# EAGLE design photon_rj45 (EAGLE 8.5.0)
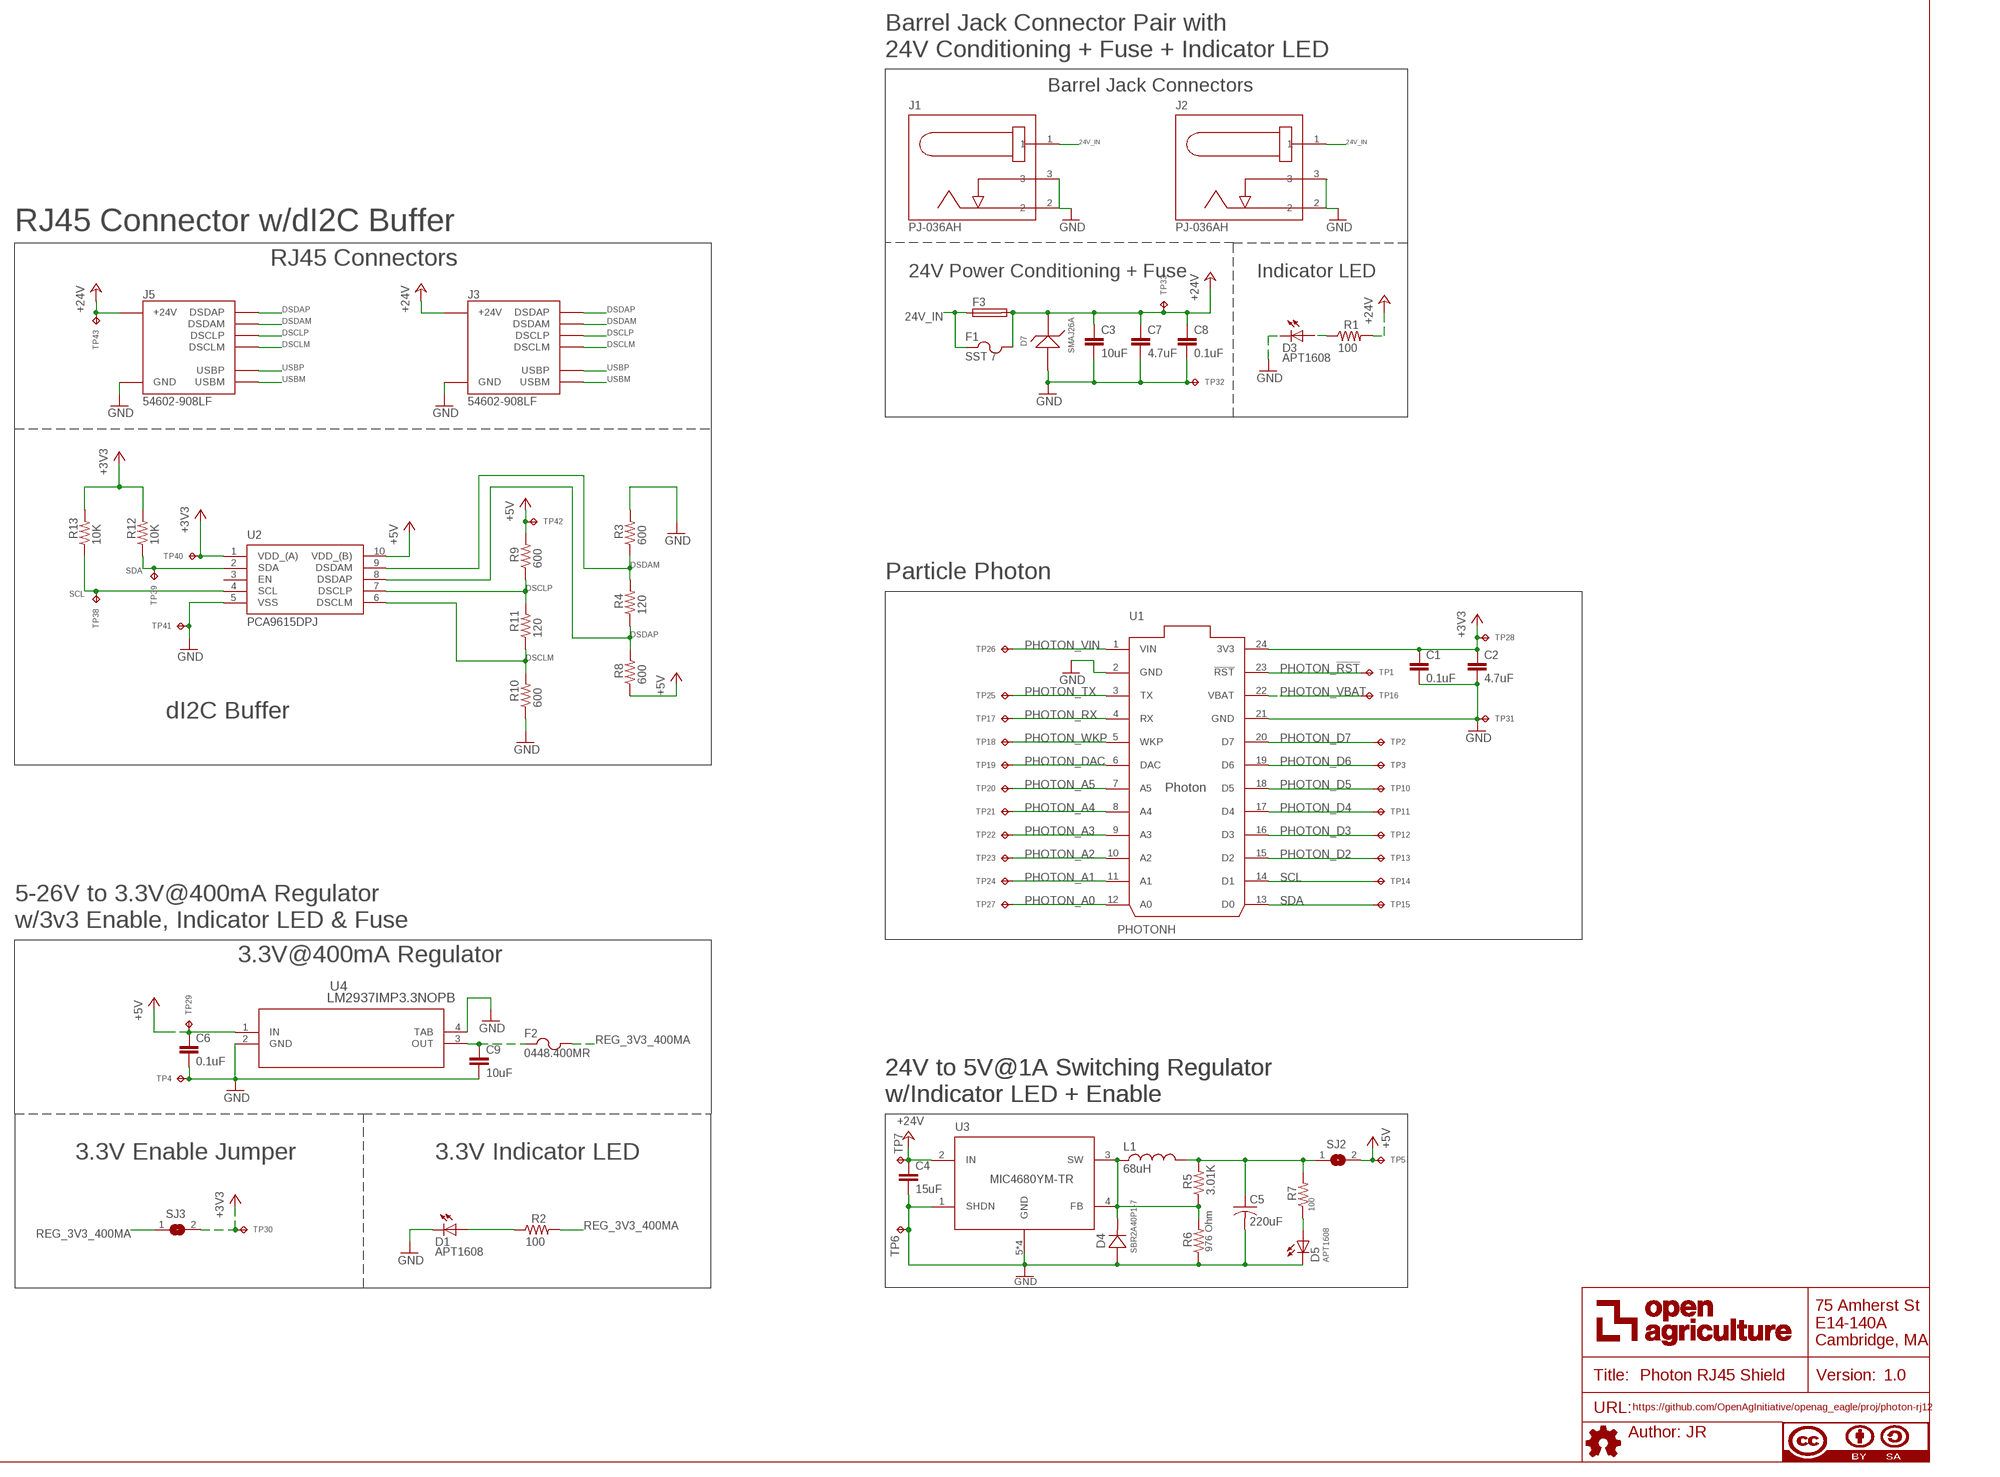
[diagram p0: schematic, sheet 1]

## Parts
C1  0.1uF  0.1UF-C0603C104K5RACTU  [C0603]
C2  4.7uF  4.7UF-CL21A475KBQNNNE  [C0805]
C3  10uF  10UF-GMK212BBJ106KG-T  [C0805]
C4  15uF  15UF-C2012X5R1V156M125AC  [C0805]
C5  220uF  220UF-TPSY227K010R0100  [CT7343]
C6  0.1uF  0.1UF-C0603C104K5RACTU  [C0603]
C7  4.7uF  4.7UF-CL21A475KBQNNNE  [C0805]
C8  0.1uF  0.1UF-C0603C104K5RACTU  [C0603]
C9  10uF  10UF-GMK212BBJ106KG-T  [C0805]
D1  APT1608  APT1608CGCK  [CHIPLED_0603]
D3  APT1608  APT1608CGCK  [CHIPLED_0603]
D4  SBR2A40P1-7  [POWERDI123]
D5  APT1608  APT1608CGCK  [CHIPLED_0603]
D7  SMAJ26A  SMAJ26A-13-F  [SMA]
F1  SST 7  SST_7  [SS]
F2  0448.400MR  0438.375WR  [0603]
F3  GSH15  [GSH15]
FRAME1  DOCFIELD  [DOCFIELD]
J1  PJ-036AH  PJ-036AH-SMT-TR  [PJ-036AH]
J2  PJ-036AH  PJ-036AH-SMT-TR  [PJ-036AH]
J3  54602-908LF  OPENAG-V1-RJ45PTH  [OPENAG-V1-RJ45]
J5  54602-908LF  OPENAG-V1-RJ45PTH  [OPENAG-V1-RJ45]
L1  68uH  68UH-UP2B-680-R  [UP2B]
R1  100  100OHM-RC0603JR-07100RL  [RC0603N]
R2  100  100OHM-RC0603JR-07100RL  [RC0603N]
R3  600  600OHM-RC0603FR-07604RL  [RC0603N]
R4  120  120OHM-RC0603FR-07120RL  [RC0603N]
R5  3.01K  3.01K-RC0603FR-073K01L  [RC0603N]
R6  976 Ohm  982OHM-RC0603FR-07976RL  [RC0603N]
R7  100  100OHM-RC0603JR-07100RL  [RC0603N]
R8  600  600OHM-RC0603FR-07604RL  [RC0603N]
R9  600  600OHM-RC0603FR-07604RL  [RC0603N]
R10  600  600OHM-RC0603FR-07604RL  [RC0603N]
R11  120  120OHM-RC0603FR-07120RL  [RC0603N]
R12  10K  10K-ERJ-3EKF1002V  [RC0603N]
R13  10K  10K-ERJ-3EKF1002V  [RC0603N]
SJ2  SOLDERJUMPERREFLOW_NOPASTE  [SOLDERJUMPER_REFLOW_NOPASTE]
SJ3  SOLDERJUMPERREFLOW_NOPASTE  [SOLDERJUMPER_REFLOW_NOPASTE]
TP1  TPTP04R  [TP04R]
TP2  TPTP04R  [TP04R]
TP3  TPTP04R  [TP04R]
TP4  TPTP06R  [TP06R]
TP5  TPTP06R  [TP06R]
TP6  TPTP06R  [TP06R]
TP7  TPTP06R  [TP06R]
TP10  TPTP04R  [TP04R]
TP11  TPTP04R  [TP04R]
TP12  TPTP04R  [TP04R]
TP13  TPTP04R  [TP04R]
TP14  TPTP04R  [TP04R]
TP15  TPTP04R  [TP04R]
TP16  TPTP04R  [TP04R]
TP17  TPTP04R  [TP04R]
TP18  TPTP04R  [TP04R]
TP19  TPTP04R  [TP04R]
TP20  TPTP04R  [TP04R]
TP21  TPTP04R  [TP04R]
TP22  TPTP04R  [TP04R]
TP23  TPTP04R  [TP04R]
TP24  TPTP04R  [TP04R]
TP25  TPTP04R  [TP04R]
TP26  TPTP04R  [TP04R]
TP27  TPTP04R  [TP04R]
TP28  TPTP04R  [TP04R]
TP29  TPTP06R  [TP06R]
TP30  TPTP06R  [TP06R]
TP31  TPTP04R  [TP04R]
TP32  TPTP06R  [TP06R]
TP33  TPTP06R  [TP06R]
TP38  TPTP06R  [TP06R]
TP39  TPTP06R  [TP06R]
TP40  TPTP06R  [TP06R]
TP41  TPTP06R  [TP06R]
TP42  TPTP06R  [TP06R]
TP43  TPTP06R  [TP06R]
U1  PHOTONH  PHOTONHPHOTONH  [PHOTON]
U2  PCA9615DPJ  [SOP50P490X110-10N]
U3  MIC4680YM-TR  [SOIC8]
U4  LM2937IMP3.3NOPB  LM2937IMP-3.3/NOPB  [MP04A]

## Nets
24V_IN: F1.1 F3.1 J1.1 J2.1
+3V3: C1.1 C2.1 R12.2 R13.2 SJ3.2 TP28.1(TP) TP30.TP TP40.TP U1.24(3V3) U2.1(VDD_(A))
+5V: C6.1 R8.1 R9.2 SJ2.2 TP5.TP TP29.TP TP42.TP U2.10(VDD_(B)) U4.1(IN)
+24V: C3.1 C4.1 C7.1 C8.1 D7.1 F1.2 F3.2 J3.24V(6)(+24V) J5.24V(6)(+24V) R1.2 TP7.TP TP33.TP TP43.TP U3.2(IN)
DSCLM: J3.DSCLM(5)(DSCLM) J5.DSCLM(5)(DSCLM) R10.2 R11.1 U2.6(DSCLM)
DSCLP: J3.DSCLP(4)(DSCLP) J5.DSCLP(4)(DSCLP) R9.1 R11.2 U2.7(DSCLP)
DSDAM: J3.DSDAM(2)(DSDAM) J5.DSDAM(2)(DSDAM) R3.1 R4.2 U2.9(DSDAM)
DSDAP: J3.DSDAP(1)(DSDAP) J5.DSDAP(1)(DSDAP) R4.1 R8.2 U2.8(DSDAP)
GND: C1.2 C2.2 C3.2 C4.2 C5.-(2(-)) C6.2 C7.2 C8.2 C9.2 D1.C D3.C D4.- D5.C D7.2 J1.2 J1.3 J2.2 J2.3 J3.GND(3)(GND) J5.GND(3)(GND) R3.2 R6.1 R10.1 TP4.TP TP6.TP TP31.1(TP) TP32.TP TP41.TP U1.2(GND) U1.21(GND) U2.5(VSS) U3.1(SHDN) U3.5(GND) U3.6(GND) U3.7(GND) U3.8(GND) U4.2(GND) U4.4(TAB)
N$4: D1.A R2.1
N$5: C9.1 F2.1 U4.3(OUT)
N$7: D3.A R1.1
N$31: D4.+ L1.1 R5.1 R6.2 U3.3(SW) U3.4(FB)
N$32: D5.A R7.1
N$33: C5.+(1(+)) L1.2 R5.2 R7.2 SJ2.1
PHOTON_!RST!: TP1.1(TP) U1.23(!RST)
PHOTON_A0: TP27.1(TP) U1.12(A0)
PHOTON_A1: TP24.1(TP) U1.11(A1)
PHOTON_A2: TP23.1(TP) U1.10(A2)
PHOTON_A3: TP22.1(TP) U1.9(A3)
PHOTON_A4: TP21.1(TP) U1.8(A4)
PHOTON_A5: TP20.1(TP) U1.7(A5)
PHOTON_D2: TP13.1(TP) U1.15(D2)
PHOTON_D3: TP12.1(TP) U1.16(D3)
PHOTON_D4: TP11.1(TP) U1.17(D4)
PHOTON_D5: TP10.1(TP) U1.18(D5)
PHOTON_D6: TP3.1(TP) U1.19(D6)
PHOTON_D7: TP2.1(TP) U1.20(D7)
PHOTON_DAC: TP19.1(TP) U1.6(DAC)
PHOTON_RX: TP17.1(TP) U1.4(RX)
PHOTON_TX: TP25.1(TP) U1.3(TX)
PHOTON_VBAT: TP16.1(TP) U1.22(VBAT)
PHOTON_VIN: TP26.1(TP) U1.1(VIN)
PHOTON_WKP: TP18.1(TP) U1.5(WKP)
REG_3V3_400MA: F2.2 R2.2 SJ3.1
SCL: R13.1 TP14.1(TP) TP38.TP U1.14(D1) U2.4(SCL)
SDA: R12.1 TP15.1(TP) TP39.TP U1.13(D0) U2.2(SDA)
USBM: J3.USBM(8)(USBM) J5.USBM(8)(USBM)
USBP: J3.USBP(7)(USBP) J5.USBP(7)(USBP)
Unconnected: U2.3(EN)

## Notes on the sheet
- Barrel Jack Connector Pair with 
  24V Conditioning + Fuse + Indicator LED
- Barrel Jack Connectors
- RJ45 Connector w/dI2C Buffer
- RJ45 Connectors
- 24V Power Conditioning + Fuse | Indicator LED
- Particle Photon
- dI2C Buffer
- 5-26V to 3.3V@400mA Regulator 
  w/3v3 Enable, Indicator LED & Fuse
- 3.3V@400mA Regulator
- 24V to 5V@1A Switching Regulator
  w/Indicator LED + Enable
- 24V to 5V@1A Switching Regulator
  w/Indicator LED + Enable
- 3.3V Enable Jumper | 3.3V Indicator LED

## Library data of the parts
C1 C6 C8 = openag-capacitors:0.1UF-C0603C104K5RACTU: Kemet - C0603C104K5RACTU - CAP CER 0.1UF 50V X7R 0603 Description: 0.1µF ±10% 50V Ceramic Capacitor X7R 0603 (1608 Metric) Technical Specifications: Capacitance: 0.1µF Tolerance: ±10% Rated Voltage: 50V Temperature Coefficient: X7R Operating Temperature: -55°C ~ 125°C Package / Case: 0603 (1608 Metric) Datasheet(s): X7R Dielectric, 6.3-250 VDC <https://search.kemet.com/component-edge/download/datasheet/C0603C104K5RACTU.pdf> Vendor(s): Digikey: 399-5089-1-ND <https://www.digikey.com/product-detail/en/kemet/C0603C104K5RACTU/399-5089-1-ND/1465623>; POPULATE: YES; VERIFIED: NO
C2 C7 = openag-capacitors:4.7UF-CL21A475KBQNNNE: Samsung - CL21A475KBQNNNE - CAP CER 4.7UF 50V X5R 0805 Description: 4.7µF ±10% 50V Ceramic Capacitor X5R 0805 (2012 Metric) Technical Specifications: Capacitance: 4.7uF Tolerance: ±10% Rated Voltage: 50V Temperature Coefficient: X5R Operating Temperature: -55°C ~ 85°C Package/Case: 0805 (2012 Metric) Datasheet(s): CL21A475KBQNNNE Characteristics <http://www.samsungsem.com/kr/front/downloadcms.do?path=/kr/support/product-search/mlcc/__icsFiles/afieldfile/2014/11/05&fileName=C_CL21A475KBQNNNE.pdf> Vendor(s): Digikey: 1276-1248-1-ND <https://www.digikey.com/product-detail/en/samsung-electro-mechanics/CL21A475KBQNNNE/1276-1248-1-ND/3889334>; POPULATE: YES; VERIFIED: NO
C3 C9 = openag-capacitors:10UF-GMK212BBJ106KG-T: Taiyo Yuden - GMK212BBJ106KG-T - CAP CER 10UF 35V X5R 0805 Description: 10µF ±10% 35V Ceramic Capacitor X5R 0805 (2012 Metric) Technical Specifications: Capacitance: 10µF Tolerance: ±10% Rated Voltage: 35V Temperature Coefficient: X5R Operating Temperature: -55°C ~ 85°C Package / Case: 0805 (2012 Metric) Datasheet(s): GMK212BBJ106KG-T Spec <http://ds.yuden.co.jp/TYCOMPAS/ut/detail.do?productNo=GMK212BBJ106KG-T&fileName=GMK212BBJ106KG-T_SS&mode=specSheetDownload> Vendor(s): Digikey: 587-4893-1-ND <https://www.digikey.com/product-detail/en/taiyo-yuden/GMK212BBJ106KG-T/587-4893-1-ND/6563736>; POPULATE: YES; VERIFIED: NO
C4 = openag-capacitors:15UF-C2012X5R1V156M125AC: TDK Corporation - C2012X5R1V156M125AC - CAP CER 15UF 35V X5R 0805 Description: 15µF ±20% 35V Ceramic Capacitor X5R 0805 (2012 Metric) Technical Specifications: Capacitance: 15µF Tolerance: ±20% Voltage - Rated: 35V Temperature Coefficient: X5R Operating Temperature: -55°C ~ 85°C Features: Low ESL Applications: General Purpose Mounting Type: Surface Mount, MLCC Package / Case: 0805 (2012 Metric) Size / Dimension: 0.079" L x 0.049" W (2.00mm x 1.25mm) Thickness (Max): 0.057" (1.45mm) Datasheet(s): C Series, General Datasheet <https://product.tdk.com/info/en/catalog/datasheets/mlcc_commercial_general_en.pdf> MLCC Part Number Guide <https://product.tdk.com/en/products/common/pdf/mlcc_partnumber_description.pdf> C Series, Gen Appl & Mid-Voltage Spec <https://product.tdk.com/info/en/catalog/spec/mlccspec_commercial_general_midvoltage_en.pdf> Vendor(s): Digikey: 445-14423-1-ND <https://www.digikey.com/product-detail/en/tdk-corporation/C2012X5R1V156M125AC/445-14423-1-ND/3956089>
C5 = openag-capacitors:220UF-TPSY227K010R0100: AVX Corporation - TPSY227K010R0100 - CAP TANT 220UF 10V 10% 2917 Description: 220µF Molded Tantalum Capacitors 10V 2917 (7343 Metric) 100 mOhm Technical Specifications: Capacitance: 220µF Tolerance: ±10% Voltage - Rated: 10V Type: Molded ESR (Equivalent Series Resistance): 100 mOhm Operating Temperature: -55°C ~ 125°C Mounting Type: Surface Mount Package / Case: 2917 (7343 Metric) Size / Dimension: 0.287" L x 0.169" W (7.30mm x 4.30mm) Height - Seated (Max): 0.079" (2.00mm) Manufacturer Size Code: Y Features: General Purpose Datasheet(s): TPS Series, Low ESR <http://datasheets.avx.com/TPS.pdf> Vendor(s): Digikey: 478-5408-1-ND <https://www.digikey.com/scripts/DkSearch/dksus.dll?Detail&itemSeq=250948888&uq=636531796868737363>
D1 D3 D5 = openag-diodes:APT1608CGCK: Kingbright - APT1608CGCK - LED GREEN CLEAR 0603 SMD Description: Green 570nm LED Indication - Discrete 2.1V 0603 (1608 Metric) Technical Specifications: Color: Green Lens Color: Colorless Lens Transparency: Clear Millicandela Rating: 50mcd Lens Style/Size: Rectangle with Flat Top, 1.20mm x 0.80mm Voltage - Forward (Vf) (Typ): 2.1V Current - Test: 20mA Viewing Angle: 120° Mounting Type: Surface Mount Wavelength - Dominant: 570nm Wavelength - Peak: 574nm Package / Case: 0603 (1608 Metric) Supplier Device Package: Chip LED Size / Dimension: 1.60mm L x 0.80mm W Height (Max): 0.75mm Datasheet(s): APT1608CGCK <http://www.kingbrightusa.com/images/catalog/SPEC/APT1608CGCK.pdf> Vendor(s): Digikey: 754-1116-1-ND <https://www.digikey.com/product-detail/en/kingbright/APT1608CGCK/754-1116-1-ND/1747833#>; POPULATE: YES; VERIFIED: NO
D4 = openag-diodes:SBR2A40P1-7: Diodes Incorporated - SBR2A40P1-7 - DIODE SBR 40V 2A POWERDI123 Description: Diode Super Barrier 40V 2A Surface Mount PowerDI™ 123 Technical Specifications: Diode Type: Super Barrier Voltage - DC Reverse (Vr) (Max): 40V Current - Average Rectified (Io): 2A Voltage - Forward (Vf) (Max) @ If: 500mV @ 2A Speed: Standard Recovery >500ns, > 200mA (Io) Current - Reverse Leakage @ Vr: 100µA @ 40V Mounting Type: Surface Mount Package / Case: POWERDI®123 Supplier Device Package: PowerDI™ 123 Operating Temperature - Junction: -65°C ~ 150°C Base Part Number: SBR2A40 Datasheet(s): SBR2A40P1 <https://www.diodes.com/assets/Datasheets/SBR2A40P1.pdf> Vendor(s): Digikey: SBR2A40P1DITR-ND <https://www.digikey.com/product-detail/en/diodes-incorporated/SBR2A40P1-7/SBR2A40P1DITR-ND/1681825>
D7 = openag-diodes:SMAJ26A-13-F: Diodes Incorporated - SMAJ26A-13-F - TVS DIODE 26VWM 42.1VC SMA Description: TVS DIODE 26VWM 42.1VC SMA Technical Specifications: Type: Zener Voltage - Reverse Standoff (Typ): 26V Voltage - Breakdown (Min): 28.9V Voltage - Clamping (Max) @ Ipp: 42.1V Current - Peak Pulse (10/1000µs): 9.5A Power - Peak Pulse: 400W Power Line Protection: No Operating Temperature: -55°C ~ 150°C (TJ) DO-214AC, SMA Datasheet(s): SMAJ5.0(C)A - SMAJ200(C)A Vendor(s): Digikey: SMAJ26A-FDICT-ND <https://www.digikey.com/product-detail/en/diodes-incorporated/SMAJ26A-13-F/SMAJ26A-FDICT-ND/806583>
F1 = openag-fuses:SST_7: Bel Fuse - SST7 - FUSE BRD MNT 7A 125VAC/VDC 2SMD Description: FUSE BRD MNT 7A 125VAC/VDC 2SMD Technical Specifications: Current Rating: 7A Voltage Rating: 125V Fuse Type: Board Mount (Cartridge Style Excluded) Mounting Type: Surface Mount Operating Temperature: -55°C ~ 125°C Datasheet(s): SST Type <https://belfuse.com/resources/StewartConnector/SST.pdf> Vendor(s): Digikey: 507-1072-1-ND <https://www.digikey.com/product-detail/en/bel-fuse-inc/SST-7/507-1072-1-ND/615026>; POPULATE: YES; VERIFIED: NO
F2 = openag-fuses:0438.375WR: Littelfuse Inc. - 0448.400MR - FUSE BOARD MNT 400MA 125VAC/VDC Description: FUSE BOARD MNT 400MA 125VAC/VDC Technical Specifications: Fuse Type: Board Mount (Cartridge Style Excluded) Current Rating: 400mA Voltage Rating - AC: 125V Voltage Rating - DC: 125V Response Time: Fast Package / Case: 2-SMD, Square End Block Mounting Type: Surface Mount Breaking Capacity @ Rated Voltage: 50A Melting I²t: 0.0416 Approvals: CSA, UL Operating Temperature: -55°C ~ 125°C Size / Dimension: 0.240" L x 0.106" W x 0.106" H (6.10mm x 2.69mm x 2.69mm) DC Cold Resistance: 0.4895 Ohms Datasheet(s): 448 Series Datasheet <http://www.littelfuse.com/~/media/electronics/datasheets/fuses/littelfuse_fuse_448_datasheet.pdf.pdf> Vendor(s): Digikey: F5573CT-ND <https://www.digikey.com/product-detail/en/littelfuse-inc/0448.400MR/F5573CT-ND/3306934>; POPULATE: YES; VERIFIED: YES
F3 = fuse:GSH15: FUSE HOLDER grid 15mm, 19649 Wickmann; MPN: 64900001039; OC_FARNELL: 1271673; OC_NEWARK: 02P0318
FRAME1 = openag-frames:DOCFIELD: DOCUMENT FIELD; AUTHOR: JR; TITLE: Photon RJ45 Shield; URL: https://github.com/OpenAgInitiative/openag_eagle/proj/photon-rj12; VER: 1.0
J1 J2 = openag-connectors:PJ-036AH-SMT-TR: CUI Inc. - PJ-036AH-SMT-TR - CONN PWR JACK 2X5.5MM SOLDER Description: Power Barrel Connector Jack 2.10mm ID (0.083"), 5.50mm OD (0.217") Surface Mount, Right Angle Technical Specifications: Connector Type: Jack Gender: Male Industry Recognized Mating Diameter: 2.10mm ID (0.083"), 5.50mm OD (0.217") Actual Diameter: 0.078" (2.00mm ID), 0.248" (6.30mm OD) Number of Positions/Contacts: 2 Conductors, 3 Contacts Internal Switch(s): Single Switch, Normally Closed Mounting Type: Surface Mount, Right Angle Termination: Solder Shielding: Unshielded Voltage - Rated: 24VDC Current Rating: 5A Mating Length/Depth: 0.360" (9.15mm) Contact Material - Plating: Silver Operating Temperature: -25°C ~ 85°C Housing Material: Polyamide (PA6T), Nylon 6T Contact Material: Brass; Copper Alloy Body Color: Black Datasheet(s): PJ-036AH-SMT-TR <http://www.cui.com/product/resource/digikeypdf/pj-036ah-smt-tr.pdf> Vendor(s): Digikey: CP-036AHPJCT-ND <https://www.digikey.com/product-detail/en/cui-inc/PJ-036AH-SMT-TR/CP-036AHPJCT-ND/1530994>
J3 J5 = openag_connector:OPENAG-V1-RJ45: Amphenol FCI - 54602-908LF - CONN MOD JACK 8P8C R/A UNSHLD Description: Jack Modular Connector 8p8c (RJ45, Ethernet) 90� Angle (Right) Unshielded Cat3 Technical Specifications: Connector Type: Jack Number of Positions/Contacts: 8p8c (RJ45, Ethernet) Number of Ports: 1 Number of Rows: 1 Mounting Type: Through Hole Orientation: 90� Angle (Right) Termination: Solder Shielding: Unshielded Ratings: Cat3 Features: Board Lock LED Color: Does Not Contain LED Tab Direction: Down Contact Material: Copper Alloy Contact Finish: Gold Contact Finish Thickness: 15�in (0.38�m) Housing Material: Polyester, Glass Filled Operating Temperature: -40�C ~ 70�C Datasheet(s): 54601-x04(zzz)WPLF Drawing <http://cdn.amphenol-icc.com/media/wysiwyg/files/drawing/c-bmj-0102.pdf> Vendor(s): Digikey: 609-1046-ND <https://www.digikey.com/product-detail/en/amphenol-fci/54602-908LF/609-1046-ND/1001360>; POPULATE: YES; VERIFIED: NO
L1 = openag-inductors:68UH-UP2B-680-R: Eaton - UP2B-680-R - FIXED IND 68UH 1.5A 178.7 MOHM Description: 68µH Unshielded Wirewound Inductor 1.5A 178.7 mOhm Max Nonstandard Technical Specifications: Type: Wirewound Material - Core: Ferrite Inductance: 68µH Tolerance: ±20% Current Rating: 1.5A Current - Saturation: 1.2A Shielding: Unshielded DC Resistance (DCR): 178.7 mOhm Max Operating Temperature: -40°C ~ 85°C Frequency - Test: 100kHz Mounting Type: Surface Mount Package / Case: Nonstandard Size / Dimension: 0.550" L x 0.410" W (13.97mm x 10.41mm) Height - Seated (Max): 0.236" (6.00mm) Datasheet(s): UNI-PAC (-R) <http://www.cooperindustries.com/content/dam/public/bussmann/Electronics/Resources/product-datasheets/BUS_Elx_PM_4308_UNI_PAC_Power_Inductors.pdf> Vendor(s): Digikey: 513-1083-1-ND <https://www.digikey.com/scripts/DkSearch/dksus.dll?Detail&itemSeq=250945518&uq=636531821133403587>
R1 R2 R7 = openag-resistors:100OHM-RC0603JR-07100RL: Yageo - RC0603JR-07100RL - RES SMD 100 OHM 5% 1/10W 0603 Description: 100 Ohms ±5% 0.1W, 1/10W Chip Resistor 0603 (1608 Metric) Moisture Resistant Thick Film Technical Specifications: Resistance: 100 Ohms Tolerance: ±5% Power (Watts): 0.1W, 1/10W Composition: Thick Film Features: Moisture Resistant Temperature Coefficient: ±100ppm/°C Operating Temperature: -55°C ~ 155°C Package / Case: 0603 (1608 Metric) Supplier Device Package: 0603 Size / Dimension: 0.063" L x 0.032" W (1.60mm x 0.80mm) Height - Seated (Max): 0.022" (0.55mm) Number of Terminations: 2 Datasheet(s): Thick Film Chip Resistor Intro <http://www.yageo.com.tw/exep/pages/download/literatures/PYu-R_INT-thick_7.pdf> Chip Resistor Marking <http://www.yageo.com/exep/pages/download/literatures/PYu-R_Marking_2.pdf> RC Series, L Datasheet <http://www.yageo.com/documents/recent/PYu-RC_Group_51_RoHS_L_8.pdf> Vendor(s): Digikey: 311-100GRCT-ND <https://www.digikey.com/product-detail/en/yageo/RC0603JR-07100RL/311-100GRCT-ND/729644>; POPULATE: YES; VERIFIED: NO
R3 R8-R10 = openag-resistors:600OHM-RC0603FR-07604RL: Yageo - RC0603FR-07604RL - RES SMD 604 OHM 1% 1/10W 0603 Description: 604 Ohms ±1% 0.1W, 1/10W Chip Resistor 0603 (1608 Metric) Moisture Resistant Thick Film Technical Specifications: Resistance: 604 Ohms Tolerance: ±1% Power (Watts): 0.1W, 1/10W Composition: Thick Film Features: Moisture Resistant Temperature Coefficient: ±100ppm/°C Operating Temperature: -55°C ~ 155°C Package / Case: 0603 (1608 Metric) Supplier Device Package: 0603 Size / Dimension: 0.063" L x 0.032" W (1.60mm x 0.80mm) Height - Seated (Max): 0.022" (0.55mm) Number of Terminations: 2 Datasheet(s): RC Series, L Datasheet <http://www.yageo.com/documents/recent/PYu-RC_Group_51_RoHS_L_8.pdf> Chip Resistor Marking <http://www.yageo.com/exep/pages/download/literatures/PYu-R_Marking_2.pdf> Vendor(s): Digikey: 311-604HRCT-ND <https://www.digikey.com/product-detail/en/yageo/RC0603FR-07604RL/311-604HRCT-ND/730276>
R4 R11 = openag-resistors:120OHM-RC0603FR-07120RL: Yageo - RC0603FR-07120RL - RES SMD 120 OHM 1% 1/10W 0603 Description: 120 Ohms ±1% 0.1W, 1/10W Chip Resistor 0603 (1608 Metric) Moisture Resistant Thick Film Technical Specifications: Resistance: 120 Ohms Tolerance: ±1% Power (Watts): 0.1W, 1/10W Composition: Thick Film Features: Moisture Resistant Temperature Coefficient: ±100ppm/°C Operating Temperature: -55°C ~ 155°C Package / Case: 0603 (1608 Metric) Supplier Device Package: 0603 Size / Dimension: 0.063" L x 0.032" W (1.60mm x 0.80mm) Height - Seated (Max): 0.022" (0.55mm) Number of Terminations: 2 Datasheet(s): RC Series, L Datasheet <http://www.yageo.com/documents/recent/PYu-RC_Group_51_RoHS_L_8.pdf> Chip Resistor Marking <http://www.yageo.com/exep/pages/download/literatures/PYu-R_Marking_2.pdf> Vendor(s): Digikey: 311-120HRCT-ND <https://www.digikey.com/product-detail/en/yageo/RC0603FR-07120RL/311-120HRCT-ND/729867>
R5 = openag-resistors:3.01K-RC0603FR-073K01L: Yageo - RC0603FR-073K01L - RES SMD 3.01K OHM 1% 1/10W 0603 Description: 3.01 kOhms ±1% 0.1W, 1/10W Chip Resistor 0603 (1608 Metric) Moisture Resistant Thick Film Technical Specifications: Resistance: 3.01 kOhms Tolerance: ±1% Power (Watts): 0.1W, 1/10W Composition: Thick Film Features: Moisture Resistant Temperature Coefficient: ±100ppm/°C Operating Temperature: -55°C ~ 155°C Package / Case: 0603 (1608 Metric) Supplier Device Package: 0603 Size / Dimension: 0.063" L x 0.032" W (1.60mm x 0.80mm) Height - Seated (Max): 0.022" (0.55mm) Number of Terminations: 2 Datasheet(s): Chip Resistor Marking <http://www.yageo.com/exep/pages/download/literatures/PYu-R_Marking_2.pdf> RC Series, L Datasheet <http://www.yageo.com/documents/recent/PYu-RC_Group_51_RoHS_L_8.pdf> Vendor(s): Digikey: 311-3.01KHRCT-ND <https://www.digikey.com/scripts/DkSearch/dksus.dll?Detail&itemSeq=250949714&uq=636531832410541188>
R6 = openag-resistors:982OHM-RC0603FR-07976RL: Yageo - RC0603FR-07976RL - RES SMD 976 OHM 1% 1/10W 0603 Description: 976 Ohms ±1% 0.1W, 1/10W Chip Resistor 0603 (1608 Metric) Moisture Resistant Thick Film Technical Specifications: Resistance: 976 Ohms Tolerance: ±1% Power (Watts): 0.1W, 1/10W Composition: Thick Film Features: Moisture Resistant Temperature Coefficient: ±100ppm/°C Operating Temperature: -55°C ~ 155°C Package / Case: 0603 (1608 Metric) Supplier Device Package: 0603 Size / Dimension: 0.063" L x 0.032" W (1.60mm x 0.80mm) Height - Seated (Max): 0.022" (0.55mm) Number of Terminations: 2 Datasheet(s): Chip Resistor Marking <http://www.yageo.com/exep/pages/download/literatures/PYu-R_Marking_2.pdf> RC Series, L Datasheet <http://www.yageo.com/documents/recent/PYu-RC_Group_51_RoHS_L_8.pdf> Vendor(s): Digikey: 311-976HRCT-ND <https://www.digikey.com/scripts/DkSearch/dksus.dll?Detail&itemSeq=250949870&uq=636531835229553061>
R12 R13 = openag-resistors:10K-ERJ-3EKF1002V: Panasonic - ERJ-3EKF1002V - RES SMD 10K OHM 1% 1/10W 0603 Description: 10 kOhms ±1% 0.1W, 1/10W Chip Resistor 0603 (1608 Metric) Automotive AEC-Q200 Thick Film Technical Specifications: Resistance: 10kOhms Tolerance: ±1% Power: 0.1W, 1/10W Operating Temperature: -55°C ~ 155°C Package/Case: 0603 (1608 Metric) Datasheet(s): ERJ-3EKF1002V View All Specifications <https://industrial.panasonic.com/ww/products/resistors/chip-resistors/general-purpose-chip-resistors/precision-thick-film-chip-resistors/ERJ3EKF1002V> Vendor(s): Digikey: P10.0KHCT-ND <https://www.digikey.com/product-detail/en/panasonic-electronic-components/ERJ-3EKF1002V/P10.0KHCT-ND/198102>; POPULATE: YES; VERIFIED: NO
SJ2 SJ3 = openag-connectors:SOLDERJUMPER: SMD Solder JUMPER Solder the two pads together to create a connection, or remove the solder to break it. REFLOW - Use this footprint for solder paste and reflow ovens. WAVE - Use this footprint for hand-soldering (larger pads). CLOSED - Has a trace between the two pads to ensure it is closed by default. The trace needs to be cut to disable the jumper, and can be closed again by creating a solder bridge between the two pads.; POPULATE: YES; VERIFIED: NO
TP1-TP7 TP10-TP33 TP38-TP43 = openag-testpads:TP: Test pad
U1 = openag-microcontrollers:PHOTONH: PARTICLE - PHOTONH - Tiny Wi-Fi dev board w/cloud backend Description: The Photon is a $19 tiny Wi-Fi development kit for creating connected projects and products for the Internet of Things. It's easy to use, it's powerful, and it's connected to the cloud. Technical Specifications: Processor: STM32F205RGY6 120Mhz ARM Cortex M3 Wireless: 802.11b/g/n Wi-Fi Peripherals: Digital(x18), ADC(x8), DAC(x2), SPI(x2), I2S(x1), I2C(x1) SPI, CAN(1), USB(1), PWM(9) Memory: 1MB flash, 128KB RAM Cerfifications: FCC, CE and IC Operating Temperature: -20°C ~ 60°C Humidity Range: Non condensing, relative humidity: 95% Supply Input Voltage (VIN): 3.6V ~ 5.5V Supply Input Voltage (3V3): 3.0V ~ 3.6V Max Supply Output Current (VIN): 1A Max Supply Output Current (3V3): 100mA Average Operating Current (WiFi on, @VIN): up to 100mA Peak Operating Current (WiFi on, @VIN): up to 430mA I/O Max Source/Sink Current (Individual): 25mA I/O Max Source/Sinnk Current (Total): 120mA Datasheet(s): Photon Datasheet <https://docs.particle.io/datasheets/photon-datasheet/> Vendor(s): Particle: PHOTONH <https://store.particle.io/products/photon>; POPULATE: YES; VERIFIED: NO
U2 = openag-buffers:PCA9615DPJ: NXP USA Inc. - PCA9615DPJ - IC REDRIVER I2C 2CH 10TSSOP Description: Buffer, ReDriver 2 Channel 400kHz 10-TSSOP Technical Specifications: Type: Buffer, ReDriver Applications: I²C Input: 2-Wire Bus Output: 2-Wire Bus Data Rate (Max): 400kHz Number of Channels: 2 Capacitance - Input: 7pF Voltage - Supply: 2.3 V ~ 5.5 V Current - Supply: 16µA Operating Temperature: -40°C ~ 85°C Package / Case: 10-TFSOP, 10-MSOP (0.118", 3.00mm Width) Supplier Device Package: 10-TSSOP Base Part Number: PCA9615 Datasheet(s): PCA9615DP <http://www.nxp.com/documents/data_sheet/PCA9615.pdf> Vendor(s): Digikey: 568-11484-1-ND <https://www.digikey.com/product-detail/en/nxp-usa-inc/PCA9615DPJ/568-11484-1-ND/4864508>
U3 = openag-regulators:MIC4680YM-TR: Microchip Technology - MIC4680YM-TR - IC REG BUCK BOOST ADJ 1.3A 8SOIC Description: Buck, Buck-Boost Switching Regulator IC Positive Adjustable 1.23V 1 Output 1.3A 8-SOIC (0.154", 3.90mm Width) Technical Specifications: Function: Step-Down, Step-Up/Step-Down Output Configuration: Positive Topology: Buck, Buck-Boost Output Type: Adjustable Number of Outputs: 1 Voltage - Input (Min): 4V Voltage - Input (Max): 34V Voltage - Output (Min/Fixed): 1.23V Voltage - Output (Max): 32.98V Current - Output: 1.3A Frequency - Switching: 200kHz Synchronous Rectifier: No Operating Temperature: -40°C ~ 125°C (TJ) Mounting Type: Surface Mount Package / Case: 8-SOIC (0.154", 3.90mm Width) Supplier Device Package: 8-SOIC Base Part Number: MIC4680 Datasheet(s): MIC4680 <http://www.microchip.com/mymicrochip/filehandler.aspx?ddocname=en579250> Vendor(s): Digikey: 576-1222-1-ND <https://www.digikey.com/scripts/DkSearch/dksus.dll?Detail&itemSeq=250950999&uq=636531791983475304>
U4 = openag-regulators:LM2937IMP-3.3/NOPB: Texas Instruments - LM2937IMP-3.3/NOPB - IC REG LIN 3.3V 400MA SOT223-4 Description: Linear Voltage Regulator IC Positive Fixed 1 Output 3.3V 400mA SOT-223-4 Technical Specifications: Output Configuration: Positive Output Type: Fixed Number of Regulators: 1 Voltage - Input (Max): 26V Voltage - Output (Min/Fixed): 3.3V Voltage Dropout (Max): 1V @ 50mA Current - Output: 400mA Current - Quiescent (Iq): 2mA Current - Supply (Max): 1.25A Protection Features: Over Temperature, Reverse Polarity, Short Circuit Operating Temperature: -40°C ~ 85°C Mounting Type: Surface Mount Package / Case: TO-261-4, TO-261AA Supplier Device Package: SOT-223-4 Base Part Number: LM2937 Datasheet(s): LM2937-2.5, LM2937-3.3 Datasheet <http://www.ti.com/lit/ds/symlink/lm2937-2.5.pdf> Vendor(s): Digikey: LM2937IMP-3.3/NOPBCT-ND <https://www.digikey.com/product-detail/en/texas-instruments/LM2937IMP-3.3-NOPB/LM2937IMP-3.3-NOPBCT-ND/270742#>; POPULATE: YES; VERIFIED: NO

## Board
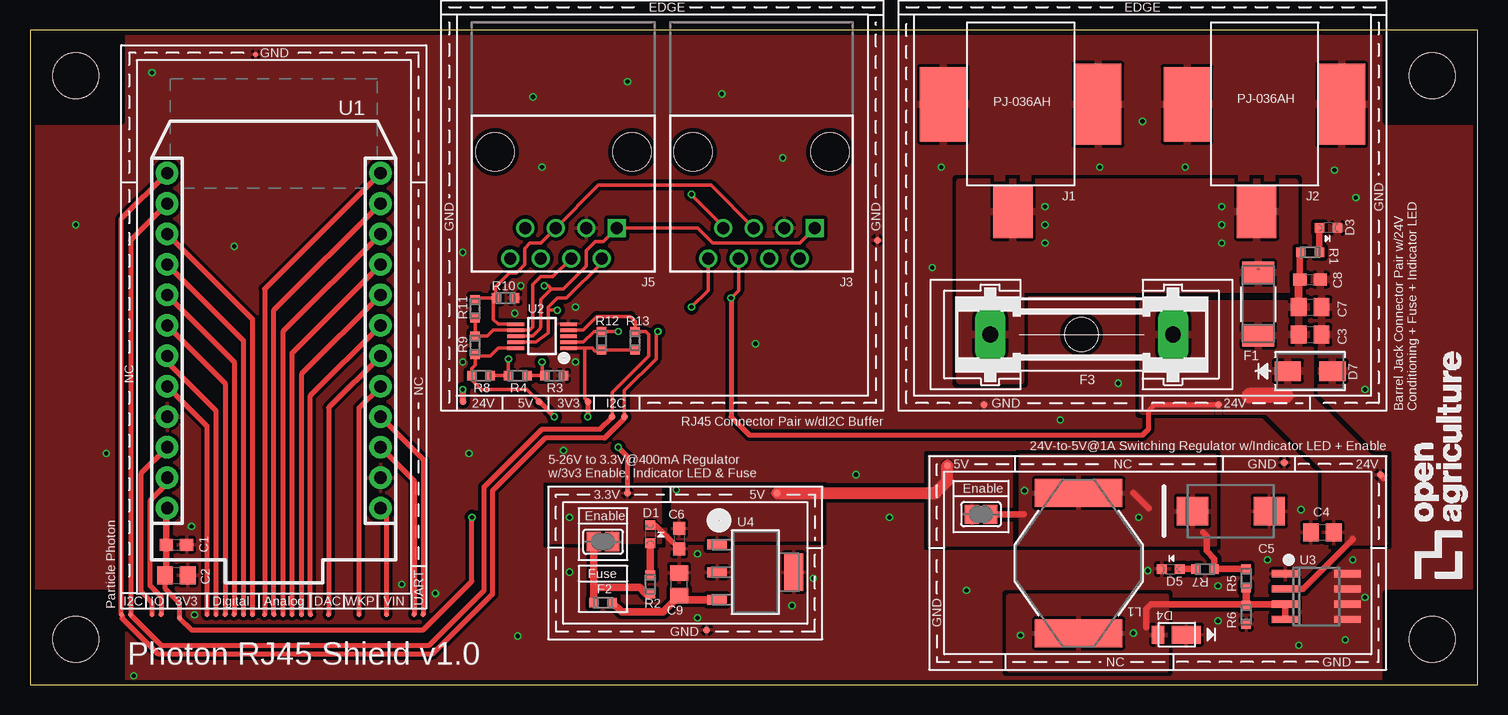
[diagram p1: board, top side]
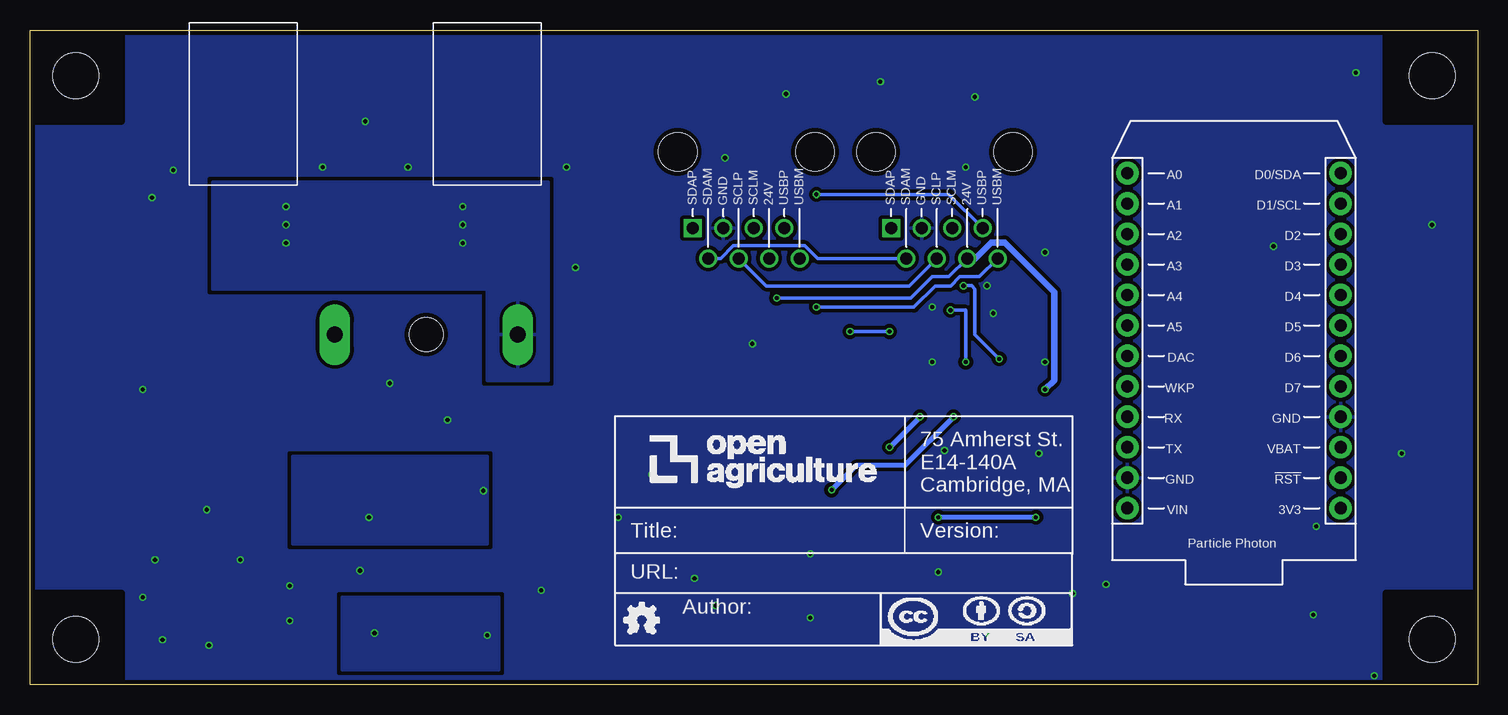
[diagram p2: board, bottom side, seen from below]

Size 120.65 x 54.61 mm. Coordinates in mm from the lower left corner, seen from the top.
Outline: 0,0 120.65,0 120.65,54.61 0,54.61 0,0
Copper layers (1*16): Top 0.035559375mm / dielectric 1.6mm / Bottom 0.035559375mm
Design rules "oshpark-2layer-mask": minimum track width 6mil, minimum drill 10mil, track to track 6mil, track to pad 6mil, pad to pad 6mil, via to via 6mil, smd to smd 6mil, copper to edge 15mil, drill to drill 6mil, minimum pad ring 5mil, minimum via ring 5mil, stop-mask expansion 2.5mil, vias tented up to drill 20mil, thermal gap 10mil
tRestrict: 1 lines

### Footprints (pad centres in the part's own frame; a part is rotated, then mirrored left to right if it is on the bottom)
C0603 = smd 1.1 x 1: 1 -0.85,0; 2 0.85,0
C0805 = smd 1.3 x 1.5: 1 -0.95,0; 2 0.95,0
CT7343 = smd 2.6 x 2.4: + -3.2,0; - 3.2,0
CHIPLED_0603 = smd 0.8 x 0.8: A 0,-0.75; C 0,0.75
POWERDI123 = smd 1.05 x 1.5: + -1.3,0 | smd 2.4 x 1.5: - 1.05,0
SMA = smd 2.18 x 1.63: 1 -1.857,0; 2 1.857,0
SS = smd 1.803 x 2.642: 1 -2.629,0; 2 2.629,0
0603 = smd 0.756 x 0.8: 1 -0.778,0; 2 0.778,0
GSH15 = drill 1.321 pad 2.54 long: 1 -7.62,0; 2 7.62,0 | hole 2.794: 0,0
PJ-036AH = smd 4.4 x 3.3: 1 2.2,-0.65 | smd 6.75 x 3.9: 2 -6.75,6.45 | smd 6.2 x 3.9: 3 -6.75,-6.45
OPENAG-V1-RJ45 = drill 1: 24V(6) 1.905,8.89; DSCLM(5) 0.635,6.35; DSCLP(4) -0.635,8.89; DSDAM(2) -3.175,8.89; GND(3) -1.905,6.35; USBM(8) 4.445,8.89; USBP(7) 3.175,6.35 | drill 1 square: DSDAP(1) -4.445,6.35 | hole 3.2: -5.715,0; 5.715,0
UP2B = smd 2.311 x 7.29: 1 -5.855,0; 2 5.855,0
RC0603N = smd 0.756 x 0.8: 1 -0.778,0; 2 0.778,0
SOLDERJUMPER_REFLOW_NOPASTE = smd 1.168 x 1.6: 1 -0.762,0; 2 0.762,0
TP04R = smd 0.4 x 0.4: 1 0,0
TP06R = smd 0.6 x 0.6: TP 0,0
PHOTON = drill 1.016 pad 1.88: 1 1.27,32.258; 2 1.27,29.718; 3 1.27,27.178; 4 1.27,24.638; 5 1.27,22.098; 6 1.27,19.558; 7 1.27,17.018; 8 1.27,14.478; 9 1.27,11.938; 10 1.27,9.398; 11 1.27,6.858; 12 1.27,4.318; 13 19.05,4.318; 14 19.05,6.858; 15 19.05,9.398; 16 19.05,11.938; 17 19.05,14.478; 18 19.05,17.018; 19 19.05,19.558; 20 19.05,22.098; 21 19.05,24.638; 22 19.05,27.178; 23 19.05,29.718; 24 19.05,32.258
SOP50P490X110-10N = smd 1.4 x 0.3: 1 -2.2,1; 2 -2.2,0.5; 3 -2.2,0; 4 -2.2,-0.5; 5 -2.2,-1; 6 2.2,-1; 7 2.2,-0.5; 8 2.2,0; 9 2.2,0.5; 10 2.2,1
SOIC8 = smd 0.6 x 2.2: 1 -1.905,-2.6; 2 -0.635,-2.6; 3 0.635,-2.6; 4 1.905,-2.6; 5 1.905,2.6; 6 0.635,2.6; 7 -0.635,2.6; 8 -1.905,2.6
MP04A = smd 1.6 x 0.838: 1 -3.2,2.3; 2 -3.2,0; 3 -3.2,-2.3 | smd 1.6 x 3.099: 4 3.2,0
OPENAG-CORNER-MOUNTING-HOLE = hole 3.81: 0,0

### Placement (x,y rotation side)
C1  12.19,11.68 0 top
C2  12.19,9.14 0 top
C3  106.68,29.21 0 top
C4  107.7,12.7 180 top
C5  100.08,14.48 0 top
C6  54.1,12.19 270 top
C7  106.68,31.5 0 top
C8  106.68,33.78 0 top
C9  54.1,8.38 90 top
D1  51.69,12.57 0 top
D3  108.2,38.1 270 top
D4  95.31,4.19 0 top
D5  95.06,9.65 90 top
D7  106.68,26.16 0 top
F1  102.36,31.75 270 top
F2  47.75,6.86 180 top
F3  87.63,29.21 0 top
FRAME1  71.88,3.3 0 bottom
J1  82.55,41.66 270 top
J2  102.87,41.66 270 top
J3  60.96,44.45 180 top
J5  44.45,44.45 180 top
L1  87.38,10.16 90 top
R1  106.68,36.07 180 top
R2  51.69,8.38 270 top
R3  43.69,25.78 0 top
R4  40.64,25.78 0 top
R5  101.35,8.89 90 top
R6  101.35,5.84 90 top
R7  97.92,9.65 0 top
R8  37.59,25.78 0 top
R9  37.08,28.32 270 top
R10  39.62,32.26 180 top
R11  37.08,31.37 270 top
R12  47.62,28.7 270 top
R13  50.42,28.7 270 top
SJ2  79.25,14.22 180 top
SJ3  47.75,11.94 0 top
TP1  10.92,5.84 90 top
TP2  14.73,5.84 90 top
TP3  15.49,5.84 90 top
TP4  56.39,4.57 0 top
TP5  76.45,18.29 0 top
TP6  104.52,18.54 0 top
TP7  112.52,17.53 0 top
TP10  16.26,5.84 90 top
TP11  17.02,5.84 90 top
TP12  17.78,5.84 90 top
TP13  18.54,5.84 90 top
TP14  8.38,5.84 90 top
TP15  7.62,5.84 90 top
TP16  10.16,5.84 90 top
TP17  32.77,5.84 90 top
TP18  27.43,5.84 90 top
TP19  24.89,5.84 90 top
TP20  23.37,5.84 90 top
TP21  22.61,5.84 90 top
TP22  21.84,5.84 90 top
TP23  21.08,5.84 90 top
TP24  20.32,5.84 90 top
TP25  32,5.84 90 top
TP26  29.72,5.84 90 top
TP27  19.56,5.84 90 top
TP28  12.45,5.59 90 top
TP29  62.23,16 0 top
TP30  49.78,16 0 top
TP31  18.8,52.58 90 top
TP32  79.5,23.37 180 top
TP33  99.06,23.37 180 top
TP38  48.51,22.35 270 top
TP39  49.53,22.35 270 top
TP40  46.48,23.62 270 top
TP41  70.61,37.08 270 top
TP42  42.42,23.62 270 top
TP43  36.07,23.62 270 top
U1  30.48,46.99 180 top
U2  42.67,29.08 180 top
U3  107.19,7.37 270 top
U4  60.45,9.4 0 top
U$1  [OPENAG-CORNER-MOUNTING-HOLE]  3.81,3.81 0 top
U$2  [OPENAG-CORNER-MOUNTING-HOLE]  3.81,50.8 270 top
U$3  [OPENAG-CORNER-MOUNTING-HOLE]  116.84,3.81 90 top
U$4  [OPENAG-CORNER-MOUNTING-HOLE]  116.84,50.8 180 top
U$5  [OPENAG-LOGO-750-MIL]  119.38,8.89 90 top

### Tracks (layer width: path | path; a pad name or v marks a point on that pad's centre or on a via)
24V_IN  (via drill 0.35)
  other vias: 99.31,36.83 99.31,38.35 99.31,39.88 84.58,39.88 84.58,36.83 84.58,38.35
  pour Top (isolate 0.305): 77.47,25.4 77.47,41.91 105.41,41.91 105.41,33.02 82.55,33.02 82.55,25.4
  pour Bottom (isolate 0.305): 105.41,41.91 77.47,41.91 77.47,25.4 82.55,25.4 82.55,33.02 105.41,33.02
+3V3  (via drill 0.35)
  Top 0.305: U2.1 46.23,28.08 | 46.23,28.08 46.85,28.08 47.08,27.85 47.55,27.85 R12.2 R13.2 | TP40.TP 46.23,23.88 46.23,28.08
  Top 0.406: C2.1 11.24,8.06 12.45,6.86 TP28.1 13.46,4.57 32.77,4.57 36.83,8.64 v36.83,13.97 | TP40.TP v46.48,22.35 | v49.02,19.81 49.78,19.05 TP30.TP
  Top 0.559: 11.24,11.58 C1.1 | C1.1 11.34,14.64 U1.24 | C1.1 11.34,8.99 C2.1
  Bottom 0.406: v46.48,22.35 v49.02,19.81 | v36.83,13.97 v44.96,13.97
  pour Top: 52.58,16.51 52.58,11.81 43.18,11.81 43.18,16.51
+5V  (via drill 0.35)
  Top 0.305: U2.10 39.01,28.08 38.35,27.43 37.12,27.43 R9.2 37.08,26.67 36.81,26.4 R8.1 36.81,25.42 37.59,24.64 41.4,24.64 TP42.TP
  Top 0.406: TP42.TP v43.69,22.35
  Top 1.016: TP29.TP 75.44,16 76.45,17.02 TP5.TP
  Bottom 0.406: v43.69,22.35 47.75,18.29 51.82,18.29 v53.85,16.26
  pour Top: 53.47,16.51 53.47,12.06 66.04,12.06 66.04,16.51
  pour Top (isolate 0.305): 74.93,11.68 81.79,11.68 81.79,19.05 74.93,19.05
+24V  (via drill 0.35)
  Top 0.305: J3.24V(6) 59.05,32.89 v58.42,32.26
  Top 0.406: v58.42,32.26 58.42,22.35 59.94,20.83 92.71,20.83 93.22,21.34 93.22,22.86 93.73,23.37 TP33.TP
  Top 0.559: U3.2 106.11,8 110.24,12.13 110.24,12.19 | 112.78,17.27 TP7.TP | C8.1 105.83,36.07 R1.2 | v36.07,24.64 TP43.TP
  Top 0.66: C7.1 105.73,33.78 C8.1
  Top 1.27: 104.65,24.13 101.6,24.13
  Bottom 0.305: 41.89,35.56 J5.24V(6) 44.07,34.04 45.47,34.04 47.24,32.26 v58.42,32.26
  Bottom 0.559: 41.89,35.56 40.56,36.89 39.43,36.89 35.31,32.77 35.31,25.4 v36.07,24.64
  pour Top: 113.03,19.05 107.76,19.05 107.76,11.75 113.03,11.75
  pour Top (isolate 0.305): 92.71,22.86 92.71,31.75 106.68,31.75 106.68,22.86
  pour Top (isolate 0.305): 106.68,24.13 101.6,24.13 101.6,22.86 102.87,22.86 107.95,17.78 113.03,17.78
DSCLM
  Top 0.305: R11.1 37.12,32.26 38.61,32.26 | 38.61,32.26 R10.2 38.77,33.19 39.94,34.35 40.51,34.35 41.21,35.06 41.21,36.39 41.66,36.83 42.55,36.83 J5.DSCLM(5) 47.37,41.66 56.77,41.66 J3.DSCLM(5) | U2.6 39.01,30.08 38.61,30.48 38.61,32.26
DSCLP
  Top 0.305: R11.2 R9.1 38.12,29.1 38.61,29.58 U2.7 41.65,29.58 41.91,29.84 41.91,33.4 42.55,34.04 43.56,34.04 J5.DSCLP(4)
  Bottom 0.305: J3.DSCLP(4) 59.31,33.27 47.37,33.27 J5.DSCLP(4)
DSDAM  (via drill 0.35)
  Top 0.305: 43.18,31.24 43.18,29.34 42.16,28.57 U2.9 | R4.2 R3.1 arc-90 42.67,25.95 v42.67,26.92 42.67,27.05 | v43.94,31.24 43.18,31.24 | 43.18,31.24 43.18,31.5 43.94,32.26 44.7,32.26 47.62,35.18 J5.DSDAM(2)
  Bottom 0.305: v42.67,26.92 42.67,31.24 v43.94,31.24 | J3.DSDAM(2) 63.09,35.56 62.03,36.62 56.08,36.62 55.02,35.56 J5.DSDAM(2)
DSDAP  (via drill 0.35)
  Top 0.305: R8.2 R4.1 39.86,27.16 v39.88,27.18 | 43.43,33.02 42.55,32.13 42.55,29.84 42.49,29.67 41.91,29.08 U2.8 | 43.43,33.02 44.45,33.02 46.35,34.92 46.35,36.2 47.12,36.96 47.75,36.96 J5.DSDAP(1) 55.63,38.1 56.9,36.83 64.14,36.83 J3.DSDAP(1) | 43.43,33.02 43.18,33.28 v42.86,33.28
  Bottom 0.305: v39.88,27.18 41.91,29.21 41.91,33.02 42.17,33.28 v42.86,33.28
GND  (via drill 0.35)
  Top 0.406: D1.C 52.12,13.32 C6.2
  other vias: 55.63,10.92 103.12,10.41 110.24,10.41 93.15,9.53 99,5.33 109.6,3.75 111.25,7.3 105.73,3.3 78.04,7.87 105.92,14.61 63.5,6.6 65.28,8.89 49.78,50.29 55.63,5.59 44.96,9.4 99,8.26 13.46,13.21 10.16,51.05 17.02,36.58 108.71,42.93 96.27,43.18 89.15,43.18 75.95,43.18 92.71,46.99 75.18,34.8 90.68,25.15 111.25,24.64 110.49,40.64 85.85,22.1 45.47,31.5 45.47,26.92 40.39,30.99 40.89,33.27 36.07,26.92 36.07,36.07 41.91,49.02 42.67,43.18 57.66,49.28 62.74,43.94 60.45,28.45 3.81,38.35 6.35,19.3 8.64,0.76 40.64,4.06 30.99,8.38 13.72,5.84 33.78,7.62 36.58,19.3 44.45,19.56 68.83,17.53 71.63,13.97
  pour Top (isolate 0.406, rank 3): 43.18,16.51 43.18,3.81 66.04,3.81 66.04,16.51
  pour Top (isolate 0.305, rank 3): 0,0 120.65,0 120.65,54.61 0,54.61
  pour Bottom (isolate 0.305, rank 3): 0,0 120.65,0 120.65,54.61 0,54.61
  pour Top (isolate 0.406, rank 2): 74.93,1.27 113.03,1.27 113.03,19.05 74.93,19.05
  pour Bottom (isolate 0.406, rank 2): 74.93,1.27 113.03,1.27 113.03,19.05 74.93,19.05
  pour Top (isolate 0.305, no thermals): 108.58,9.84 111.32,9.84 111.32,4.76 108.58,4.76
  pour Top (isolate 0.305): 33.02,6.35 33.02,53.34 7.62,53.34 7.62,6.35
  pour Bottom (isolate 0.305): 33.02,6.35 7.62,6.35 7.62,53.34 33.02,53.34
  pour Top (isolate 0.305, rank 2): 72.39,22.86 72.39,57.15 113.03,57.15 113.03,22.86
  pour Bottom (isolate 0.305, rank 3): 72.39,22.86 113.03,22.86 113.03,57.15 72.39,57.15
  pour Top (isolate 0.305): 34.29,57.15 34.29,22.86 71.12,22.86 71.12,57.15
  pour Bottom (isolate 0.305): 34.29,22.86 71.12,22.86 71.12,57.15 34.29,57.15
N$4
  Top 0.61: D1.A R2.1
N$5
  Top 0.61: 54.28,7.1 C9.1 | C9.1 54.44,7.1 U4.3 | F2.1 49.29,6.1 52.77,6.1 C9.1
N$7
  Top 0.559: R1.1 D3.A
N$31  (via drill 0.35)
  Top 0.559: 101.46,6.73 U3.3 U3.4 | 101.46,6.73 R6.2 | 93.03,4.78 93.03,6.35 93.41,6.73 101.46,6.73
  Top 0.61: R5.1 R6.2
  other vias: 91.95,4.32 82.55,4.13
  pour Top (isolate 0.305): 81.53,7.37 81.53,1.27 94.74,1.27 94.74,7.37
  pour Bottom (isolate 0.305): 81.6,1.27 81.6,7.3 94.61,7.3 94.61,1.27
N$32
  Top 0.559: R7.1 D5.A
N$33  (via drill 0.35)
  Top 0.559: 91.94,16.02 93.22,14.73 | R5.2 98.71,9.67 R7.2 98.69,10.53 98.06,11.16 98.06,12.43 97.79,12.7 | SJ2.1 82.8,14.22
  Top 0.61: SJ2.1 80.03,14.24
  other vias: 92.39,13.97 82.87,16.19
  pour Top: 82.55,19.05 82.55,11.75 98.74,11.75 98.74,19.05
  pour Bottom (isolate 0.305): 82.55,19.05 82.55,11.75 98.74,11.75 98.74,19.05
PHOTON_!RST!
  Top 0.406: U1.23 11.43,16.78 9.98,15.33 9.98,8.29 10.92,7.35 TP1.1
PHOTON_A0
  Top 0.406: U1.12 19.56,33.02 TP27.1
PHOTON_A1
  Top 0.406: U1.11 20.32,31.24 TP24.1
PHOTON_A2
  Top 0.406: U1.10 21.08,29.46 TP23.1
PHOTON_A3
  Top 0.406: U1.9 21.84,27.69 TP22.1
PHOTON_A4
  Top 0.406: U1.8 22.61,25.91 TP21.1
PHOTON_A5
  Top 0.406: U1.7 23.37,24.13 TP20.1
PHOTON_D2
  Top 0.406: U1.15 18.54,30.48 TP13.1
PHOTON_D3
  Top 0.406: U1.16 17.78,28.7 TP12.1
PHOTON_D4
  Top 0.406: U1.17 17.02,26.92 TP11.1
PHOTON_D5
  Top 0.406: U1.18 16.26,25.15 TP10.1
PHOTON_D6
  Top 0.406: U1.19 11.43,26.94 15.49,22.88 TP3.1
PHOTON_D7
  Top 0.406: U1.20 14.73,21.59 TP2.1
PHOTON_DAC
  Top 0.406: U1.6 24.89,23.11 TP19.1
PHOTON_RX
  Top 0.406: U1.4 32.77,18.8 TP17.1
PHOTON_TX
  Top 0.406: U1.3 32,17.02 TP25.1
PHOTON_VBAT
  Top 0.406: U1.22 9.27,17.65 9.27,7.74 10.16,6.85 TP16.1
PHOTON_VIN
  Top 0.406: U1.1 29.72,14.22 TP26.1
PHOTON_WKP
  Top 0.406: U1.5 27.43,23.11 TP18.1
REG_3V3_400MA
  Top 0.61: SJ3.1 46.97,8.13 | 46.97,8.13 F2.2 | R2.2 51.32,7.6 50.8,8.13 46.97,8.13
SCL
  Top 0.305: U2.4 46.09,29.58 47.24,30.73 50.04,30.73 50.42,30.35 R13.1 50.44,29.46 51.31,29.46 51.56,29.21 51.56,27.43 48.51,24.38 TP38.TP
  Top 0.406: U1.14 8.38,37.08 TP14.1 10.92,3.3 33.27,3.3 37.85,7.87 37.85,16.51 42.67,21.34 47.5,21.34 TP38.TP
SDA  (via drill 0.35)
  Top 0.305: U2.2 46.11,28.58 47.01,29.48 R12.1 49.01,29.48 v49.02,29.46 | v52.32,29.46 52.17,29.31 52.17,27.18 49.53,24.54 TP39.TP
  Top 0.406: U1.13 7.62,38.86 TP15.1 7.67,5.79 7.67,5.55 10.63,2.59 33.57,2.59 38.56,7.58 38.56,16.2 42.93,20.57 47.88,20.57 49.53,22.23 TP39.TP
  Bottom 0.305: v49.02,29.46 v52.32,29.46
USBM  (via drill 0.35)
  Top 0.305: v55.12,31.5 56.52,32.89 J3.USBM(8)
  Bottom 0.305: v55.12,31.5 46.99,31.5 45.21,33.27 43.94,33.27 43.17,34.04 41.53,34.04 J5.USBM(8)
USBP  (via drill 0.35)
  Top 0.305: v55.12,40.89 57.78,38.23 J3.USBP(7)
  Bottom 0.305: v55.12,40.89 44.07,40.89 J5.USBP(7)

### Text on the board
tPlace: EDGE | EDGE | GND | GND | GND | GND | NC | NC | GND | 24V | 24V | 5V | 3V3 | I2C | Barrel Jack Connector Pair w/24V / Conditioning + Fuse + Indicator LED | RJ45 Connector Pair w/dI2C Buffer | 24V-to-5V@1A Switching Regulator w/Indicator LED + Enable | 5V | NC | GND | 24V | 5-26V to 3.3V@400mA Regulator / w/3v3 Enable, Indicator LED & Fuse | Enable | 3.3V | 5V | Enable | Fuse | I2C | IO | 3V3 | Digital | Analog | DAC | WKP | VIN | UART | Particle Photon | GND | GND | Photon RJ45 Shield v1.0 | NC | GND